# Altium project FM_V03_BASE.PrjPcb
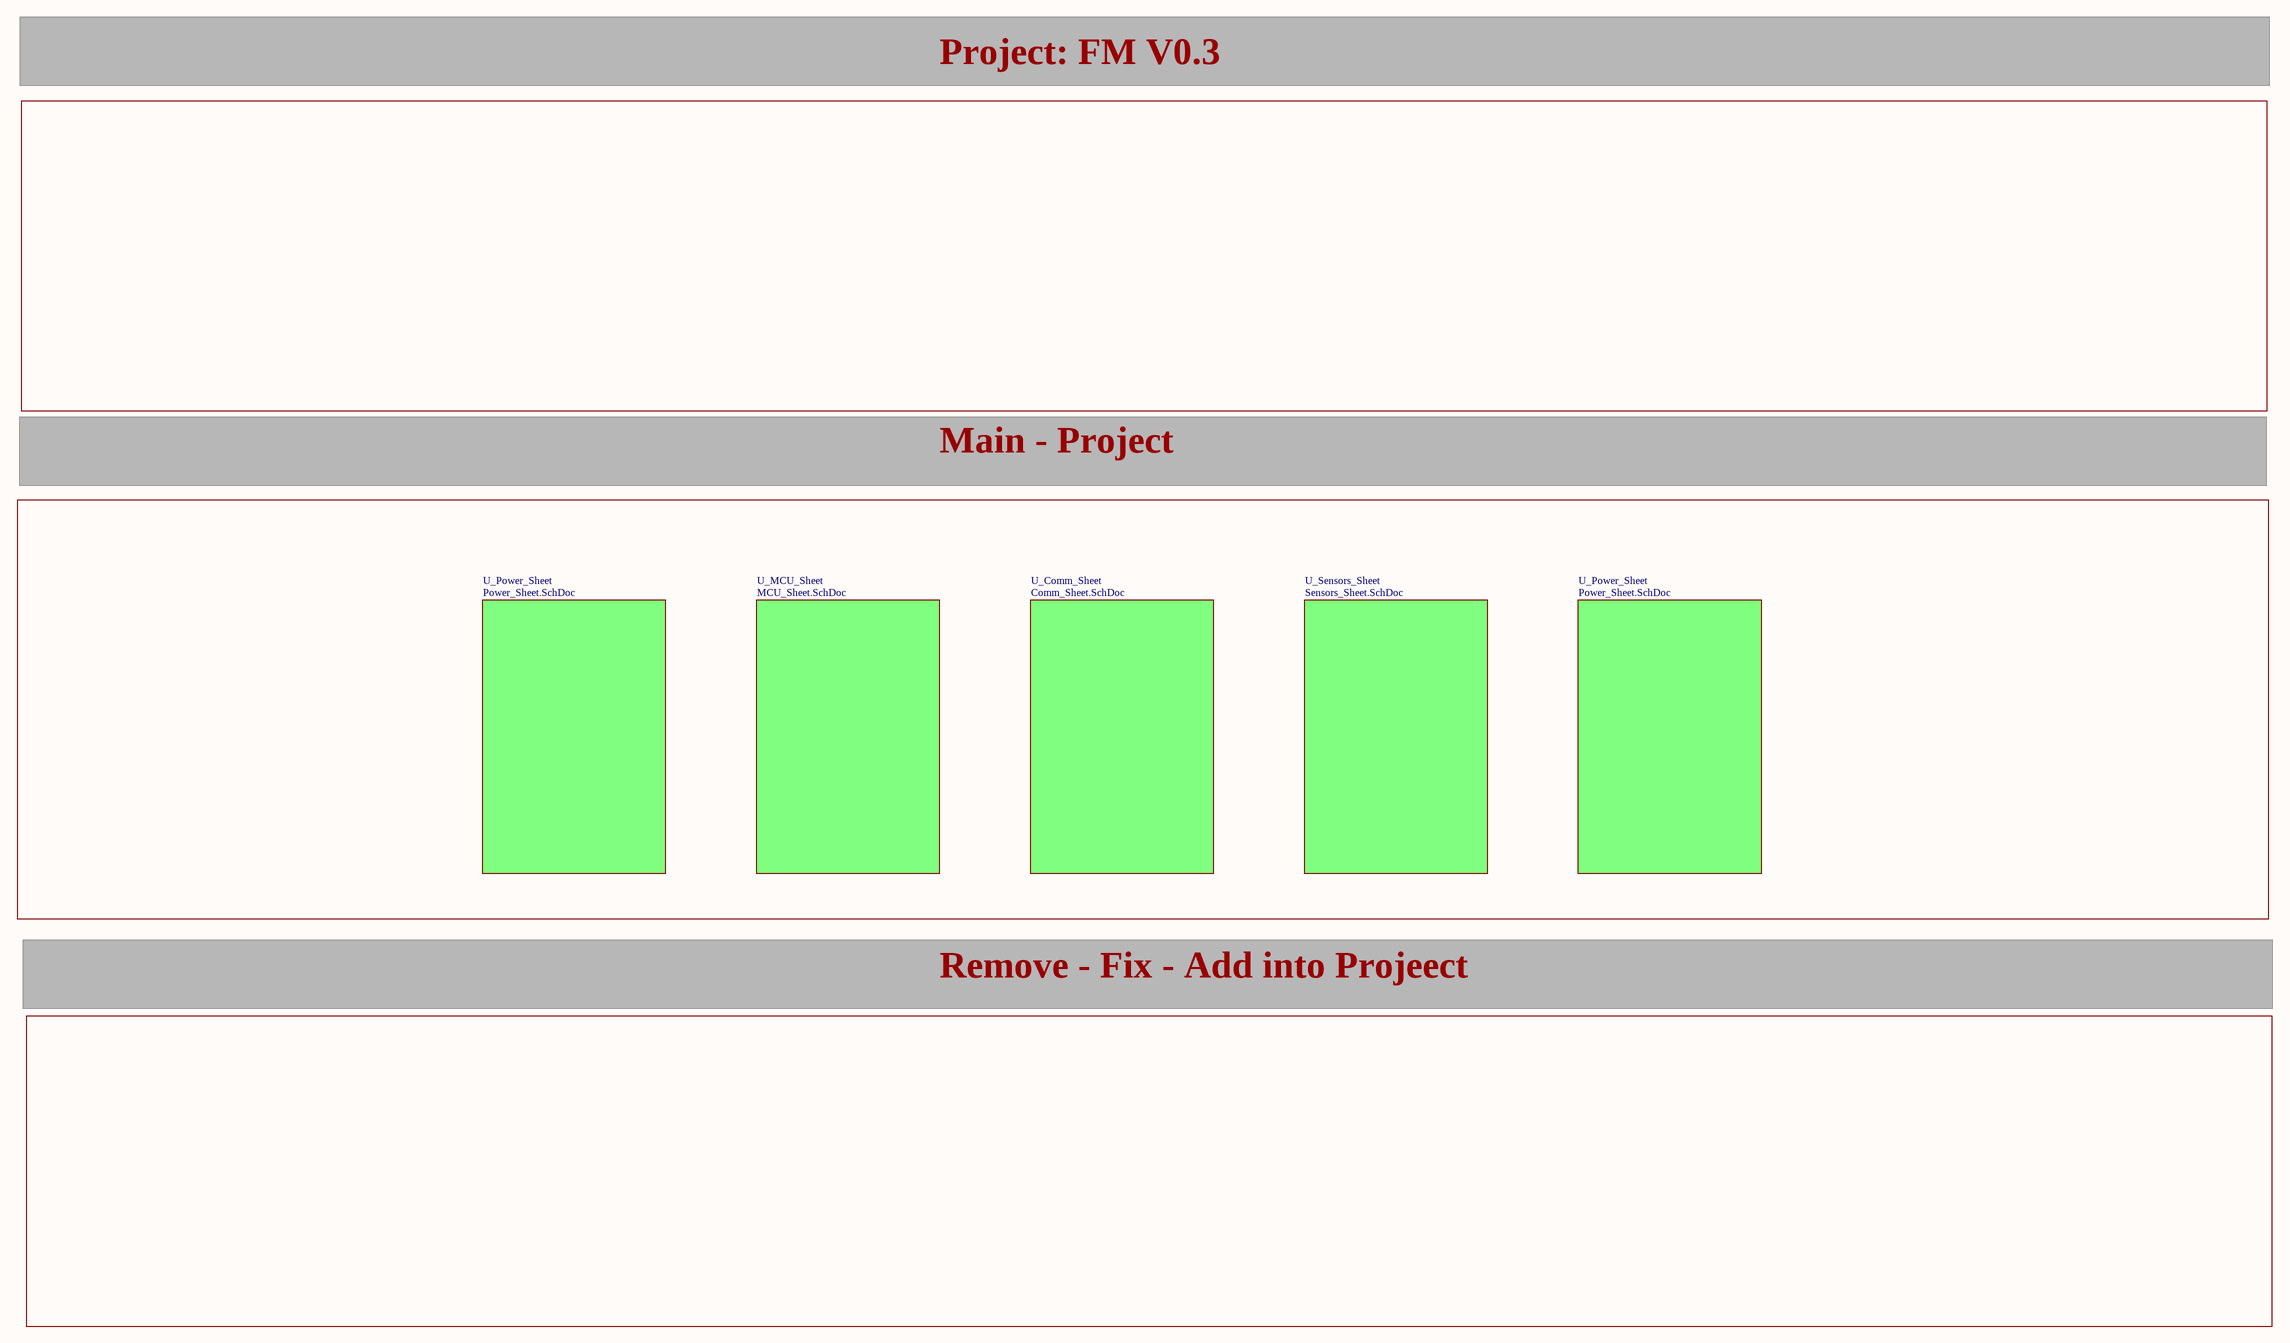
[diagram p0: Main_Sheet.SchDoc]
5 sheets, 199 parts. Net scope: flat (ports and power ports of the same name join across sheets).
Board file: PCB_FM_V03_BASE.PcbDoc
Sheets:
  Main_Sheet.SchDoc
    U_Power_Sheet = Power_Sheet.SchDoc
    U_MCU_Sheet = MCU_Sheet.SchDoc
    U_Comm_Sheet = Comm_Sheet.SchDoc
    U_Sensors_Sheet = Sensors_Sheet.SchDoc
    U_Power_Sheet = Power_Sheet.SchDoc

## Sheet Main_Sheet.SchDoc
size A2; SheetNumber: 1; SheetTotal: 5

### Sub-sheets
U_Comm_Sheet = Comm_Sheet.SchDoc: no entries
U_MCU_Sheet = MCU_Sheet.SchDoc: no entries
U_Power_Sheet = Power_Sheet.SchDoc: no entries
U_Power_Sheet = Power_Sheet.SchDoc: no entries
U_Sensors_Sheet = Sensors_Sheet.SchDoc: no entries

### Notes on the sheet
- Project: FM V0.3
- Main - Project
- Remove - Fix - Add into Projeect

## Sheet Power_Sheet.SchDoc
size A3; SheetNumber: 2; SheetTotal: 5
Used 2 times, as channels U_Power_Sheet, U_Power_Sheet. Parts and nets are listed once, with the designators drawn on the sheet.
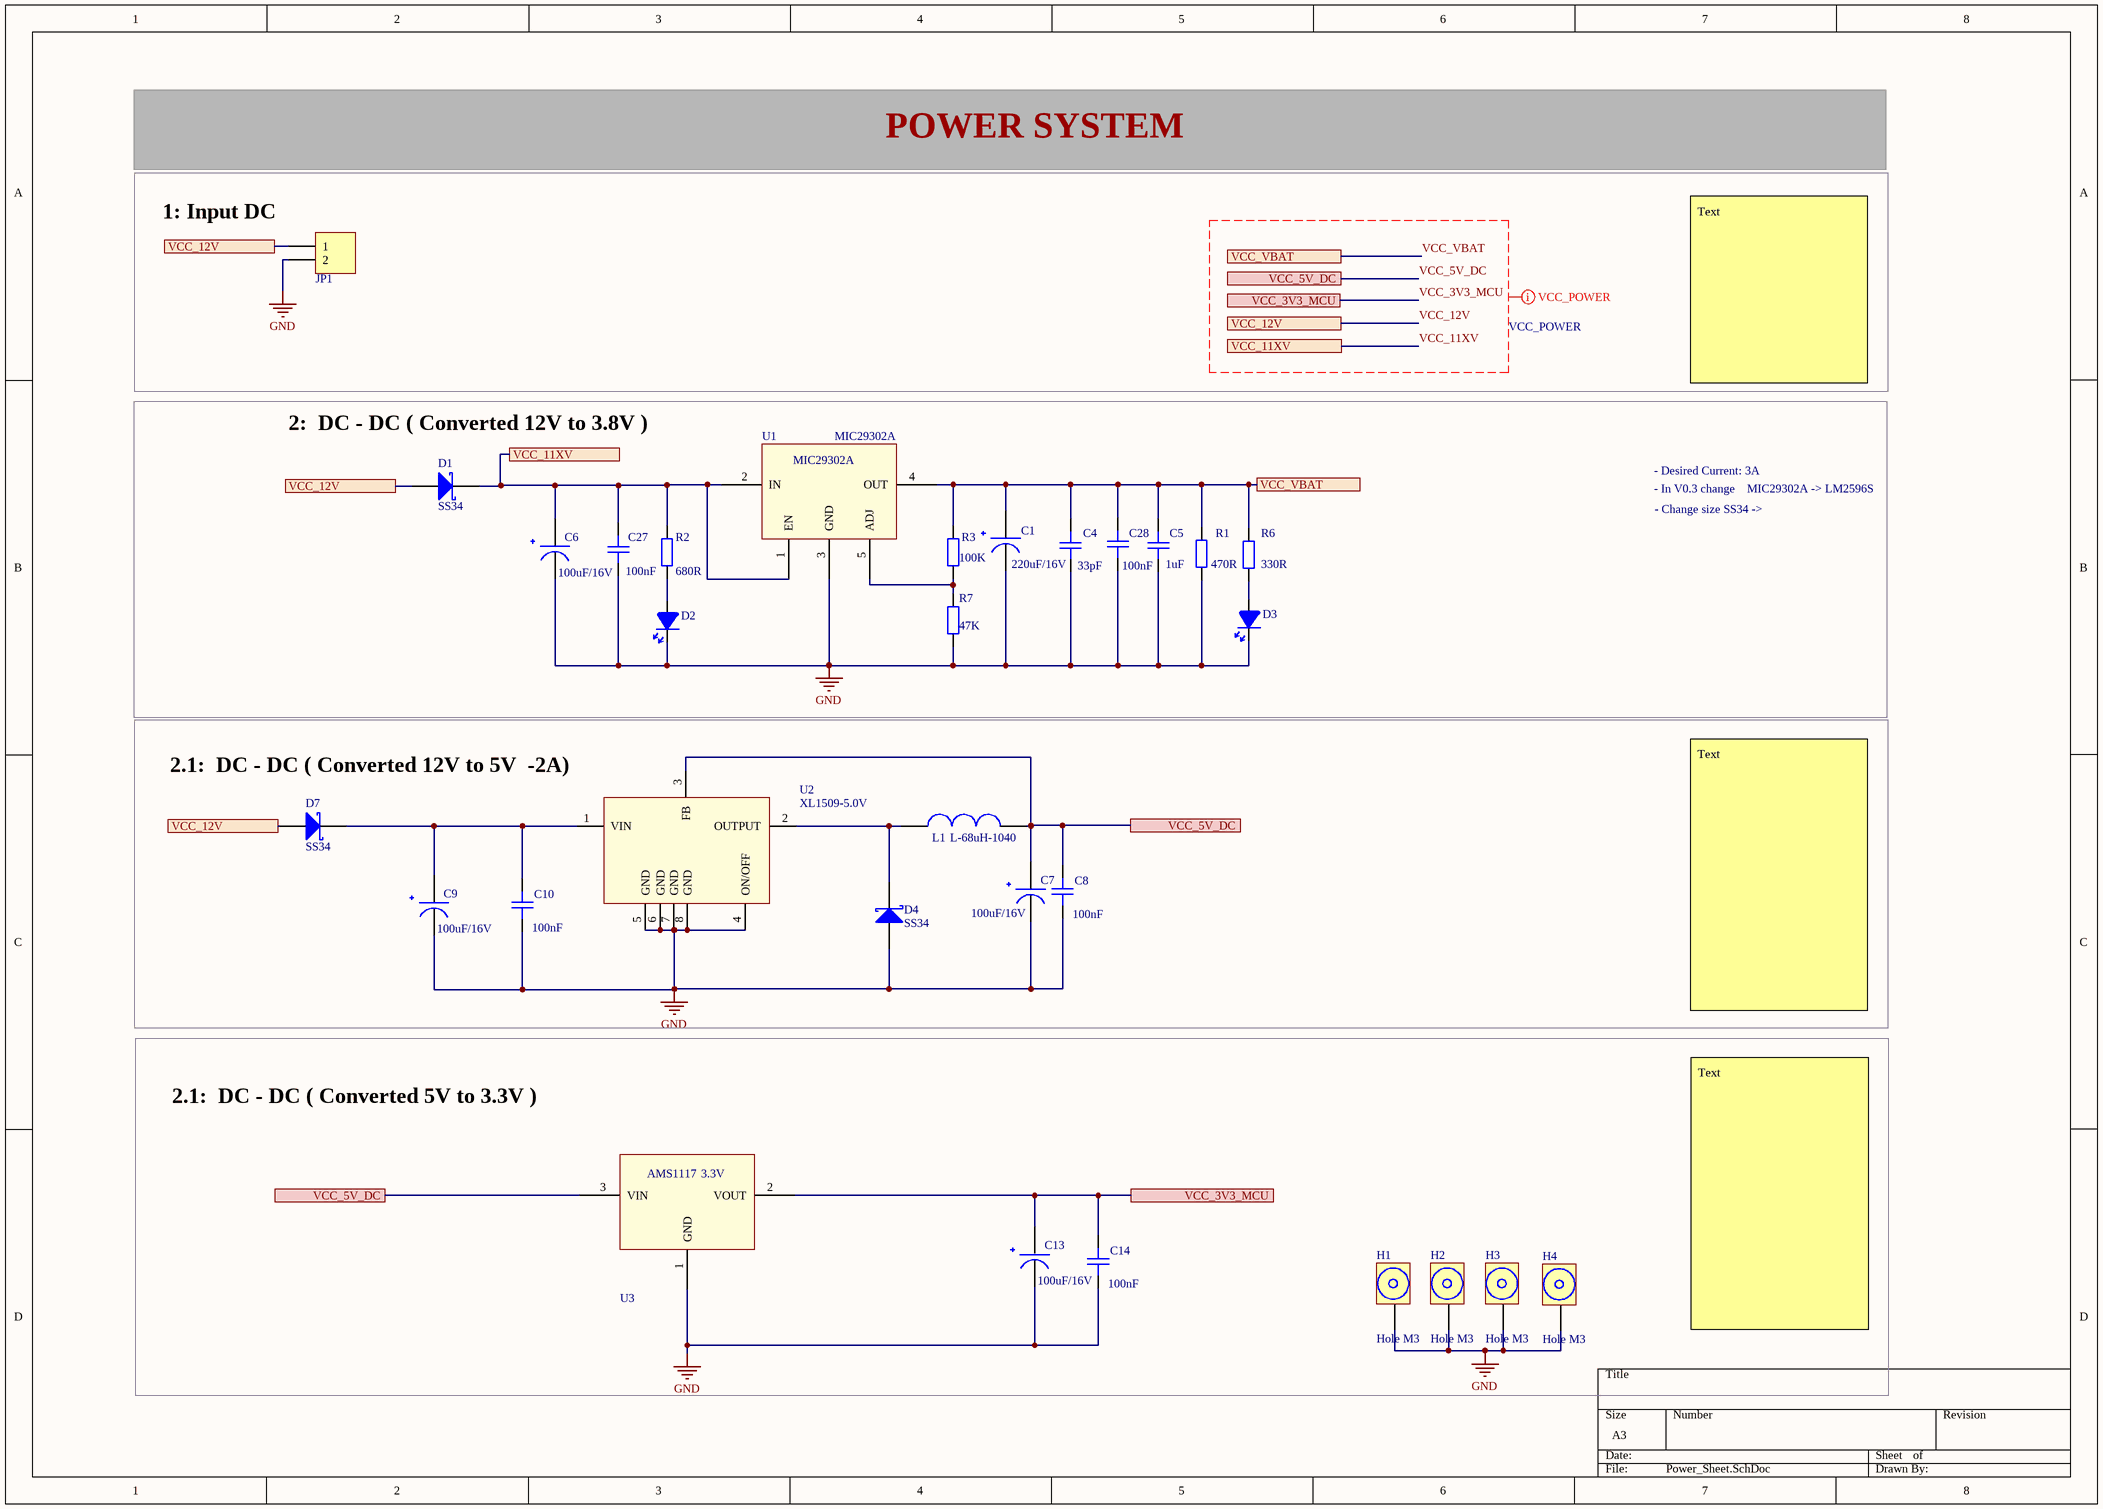
[diagram p1: Power_Sheet.SchDoc]

### Parts
C1  220uF/16V  [CAPACITOR 6.3x7.7mm]
C4  33pF  [CAPC-0603 (1608)]
C5  1uF  [CAPC-0603 (1608)]
C6  100uF/16V  [CAP 6.3MMx5.4MM]
C7  100uF/16V  [CAP 6.3MMx5.4MM]
C8  100nF  [CAPC-0603 (1608)]
C9  100uF/16V  [CAP 6.3MMx5.4MM]
C10  100nF  [CAPC-0603 (1608)]
C13  100uF/16V  [CAP 6.3MMx5.4MM]
C14  100nF  [CAPC-0603 (1608)]
C27  100nF  [CAPC-0603 (1608)]
C28  100nF  [CAPC-0603 (1608)]
D1  SS34  [DIODE_DO214AC_SMA]
D2  LED_0805_PW  [LED_0805_PW]  (value not drawn)
D3  LED_0805_PW  [LED_0805_PW]  (value not drawn)
D4  SS34  [DIODE_DO214AC_SMA]
D7  SS34  [DIODE_DO214AC_SMA]
H1  Hole M3  [Hole Size 3M]
H2  Hole M3  [Hole Size 3M]
H3  Hole M3  [Hole Size 3M]
H4  Hole M3  [Hole Size 3M]
JP1  Header 2_1  [HED2]  (value not drawn)
L1  L-68uH-1040  [68uH - 2A - 1040]
R1  470R  [RESC-0603 (1608)]
R2  680R  [RESC-0603 (1608)]
R3  100K  [RESC-0603 (1608)]
R6  330R  [RESC-0603 (1608)]
R7  47K  [RESC-0603 (1608)]
U1  MIC29302A  [MIC29302A]
U2  XL1509-5.0V  [XL1509-5V]
U3  AMS1117 - 3.3V  [AMS1117 -3.3V]  (value not drawn)

### Blocks framed on the sheet
1: Input DC: JP1
2:  DC - DC ( Converted 12V to 3.8V ): C1 C4-C6 C27 C28 D1-D3 R1-R3 R6 R7 U1
2.1:  DC - DC ( Converted 12V to 5V  -2A): C7-C10 D4 D7 L1 U2
2.1:  DC - DC ( Converted 5V to 3.3V ): C13 C14 H1-H4 U3

### Ports
VCC_3V3_MCU, VCC_5V_DC, VCC_11XV, VCC_12V, VCC_VBAT

### Nets
GND: C1.2 C4.1 C5.1 C6.2 C7.2 C8.1 C9.2 C10.1 C13.2 C14.1 C27.1 C28.1 D2.2(K) D3.2(K) D4.1(A) H1.1(GND) H2.1(GND) H3.1(GND) H4.1(GND) JP1.2 R1.1 R7.1 U1.3(GND) U2.4(ON/OFF) U2.5(GND) U2.6(GND) U2.7(GND) U2.8(GND) U3.1(GND)
VCC_3V3_MCU: C13.1 C14.2 U3.2(VOUT) ; port VCC_3V3_MCU
VCC_5V_DC: C7.1 C8.2 L1.2 U2.3(FB) U3.3(VIN) ; port VCC_5V_DC
VCC_11XV: C6.1 C27.2 D1.2(K) R2.2 U1.1(EN) U1.2(IN) ; port VCC_11XV
VCC_12V: D1.1(A) D7.1(A) JP1.1 ; port VCC_12V
VCC_VBAT: C1.1 C4.2 C5.2 C28.2 R1.2 R3.1 R6.2 U1.4(OUT) ; port VCC_VBAT
NetC9_1: C9.1 C10.2 D7.2(K) U2.1(VIN)
NetD2_1: D2.1(A) R2.1
NetD3_1: D3.1(A) R6.1
NetD4_2: D4.2(K) L1.1 U2.2(OUTPUT)
NetR3_2: R3.2 R7.2 U1.5(ADJ)

### Channels
U_Power_Sheet: designators end in _U_Power_Sheet#1; ports VCC_3V3_MCU=VCC_3V3_MCU VCC_5V_DC=VCC_5V_DC VCC_11XV=VCC_11XV VCC_12V=VCC_12V VCC_VBAT=VCC_VBAT
U_Power_Sheet: designators end in _U_Power_Sheet#2; ports VCC_3V3_MCU=VCC_3V3_MCU VCC_5V_DC=VCC_5V_DC VCC_11XV=VCC_11XV VCC_12V=VCC_12V VCC_VBAT=VCC_VBAT

### Layout directives
net class VCC_POWER: VCC_3V3_MCU, VCC_5V_DC, VCC_11XV, VCC_12V, VCC_VBAT

### Notes on the sheet
- POWER SYSTEM
- Text
- - Desired Current: 3A
- - In V0.3 change    MIC29302A -> LM2596S
- - Change size SS34 ->
- (in symbol AMS1117 - 3.3V) AMS1117; 3.3V

### Library data of the parts
C1 = CAP 220uF: Capacitor 220uF - 16V. Size 6.3x7,7mm
C4 C5 C8 C10 C14 C27 C28 = CAPC NF 0603: CAP SMD, Not Fill, 0603; Value: NF; Solder: Not Fill; Category: CAPACITOR
C6 C7 C9 C13 = CAP 100uF: Capacitor 100uF - 16V. Size 6.3x5.4mm
D1 D4 D7 = SS34: DIODE SCHOTTKY 40V 3A SMA; Solder: SMT; MPN: SS34; Value: SS34; MFR: *
JP1 = Header 2_1: Header, 2-Pin; Manufacturer: Generic Components; Class: Connector; Value: Header 2
R1-R3 R6 R7 = CRCW06035R10FKEA: RES SMD 5.1 OHM 1% 1/10W 0603; MFR: Vishay Dale; Value: 5.1R; Solder: SMT; MPN: CRCW06035R10FKEA; Category: RESISTOR; PinCount: 2
U2 = XL1509-5V: XL1509-5V FROM XLSEMI

## Sheet MCU_Sheet.SchDoc
size A2; SheetNumber: 3; SheetTotal: 5
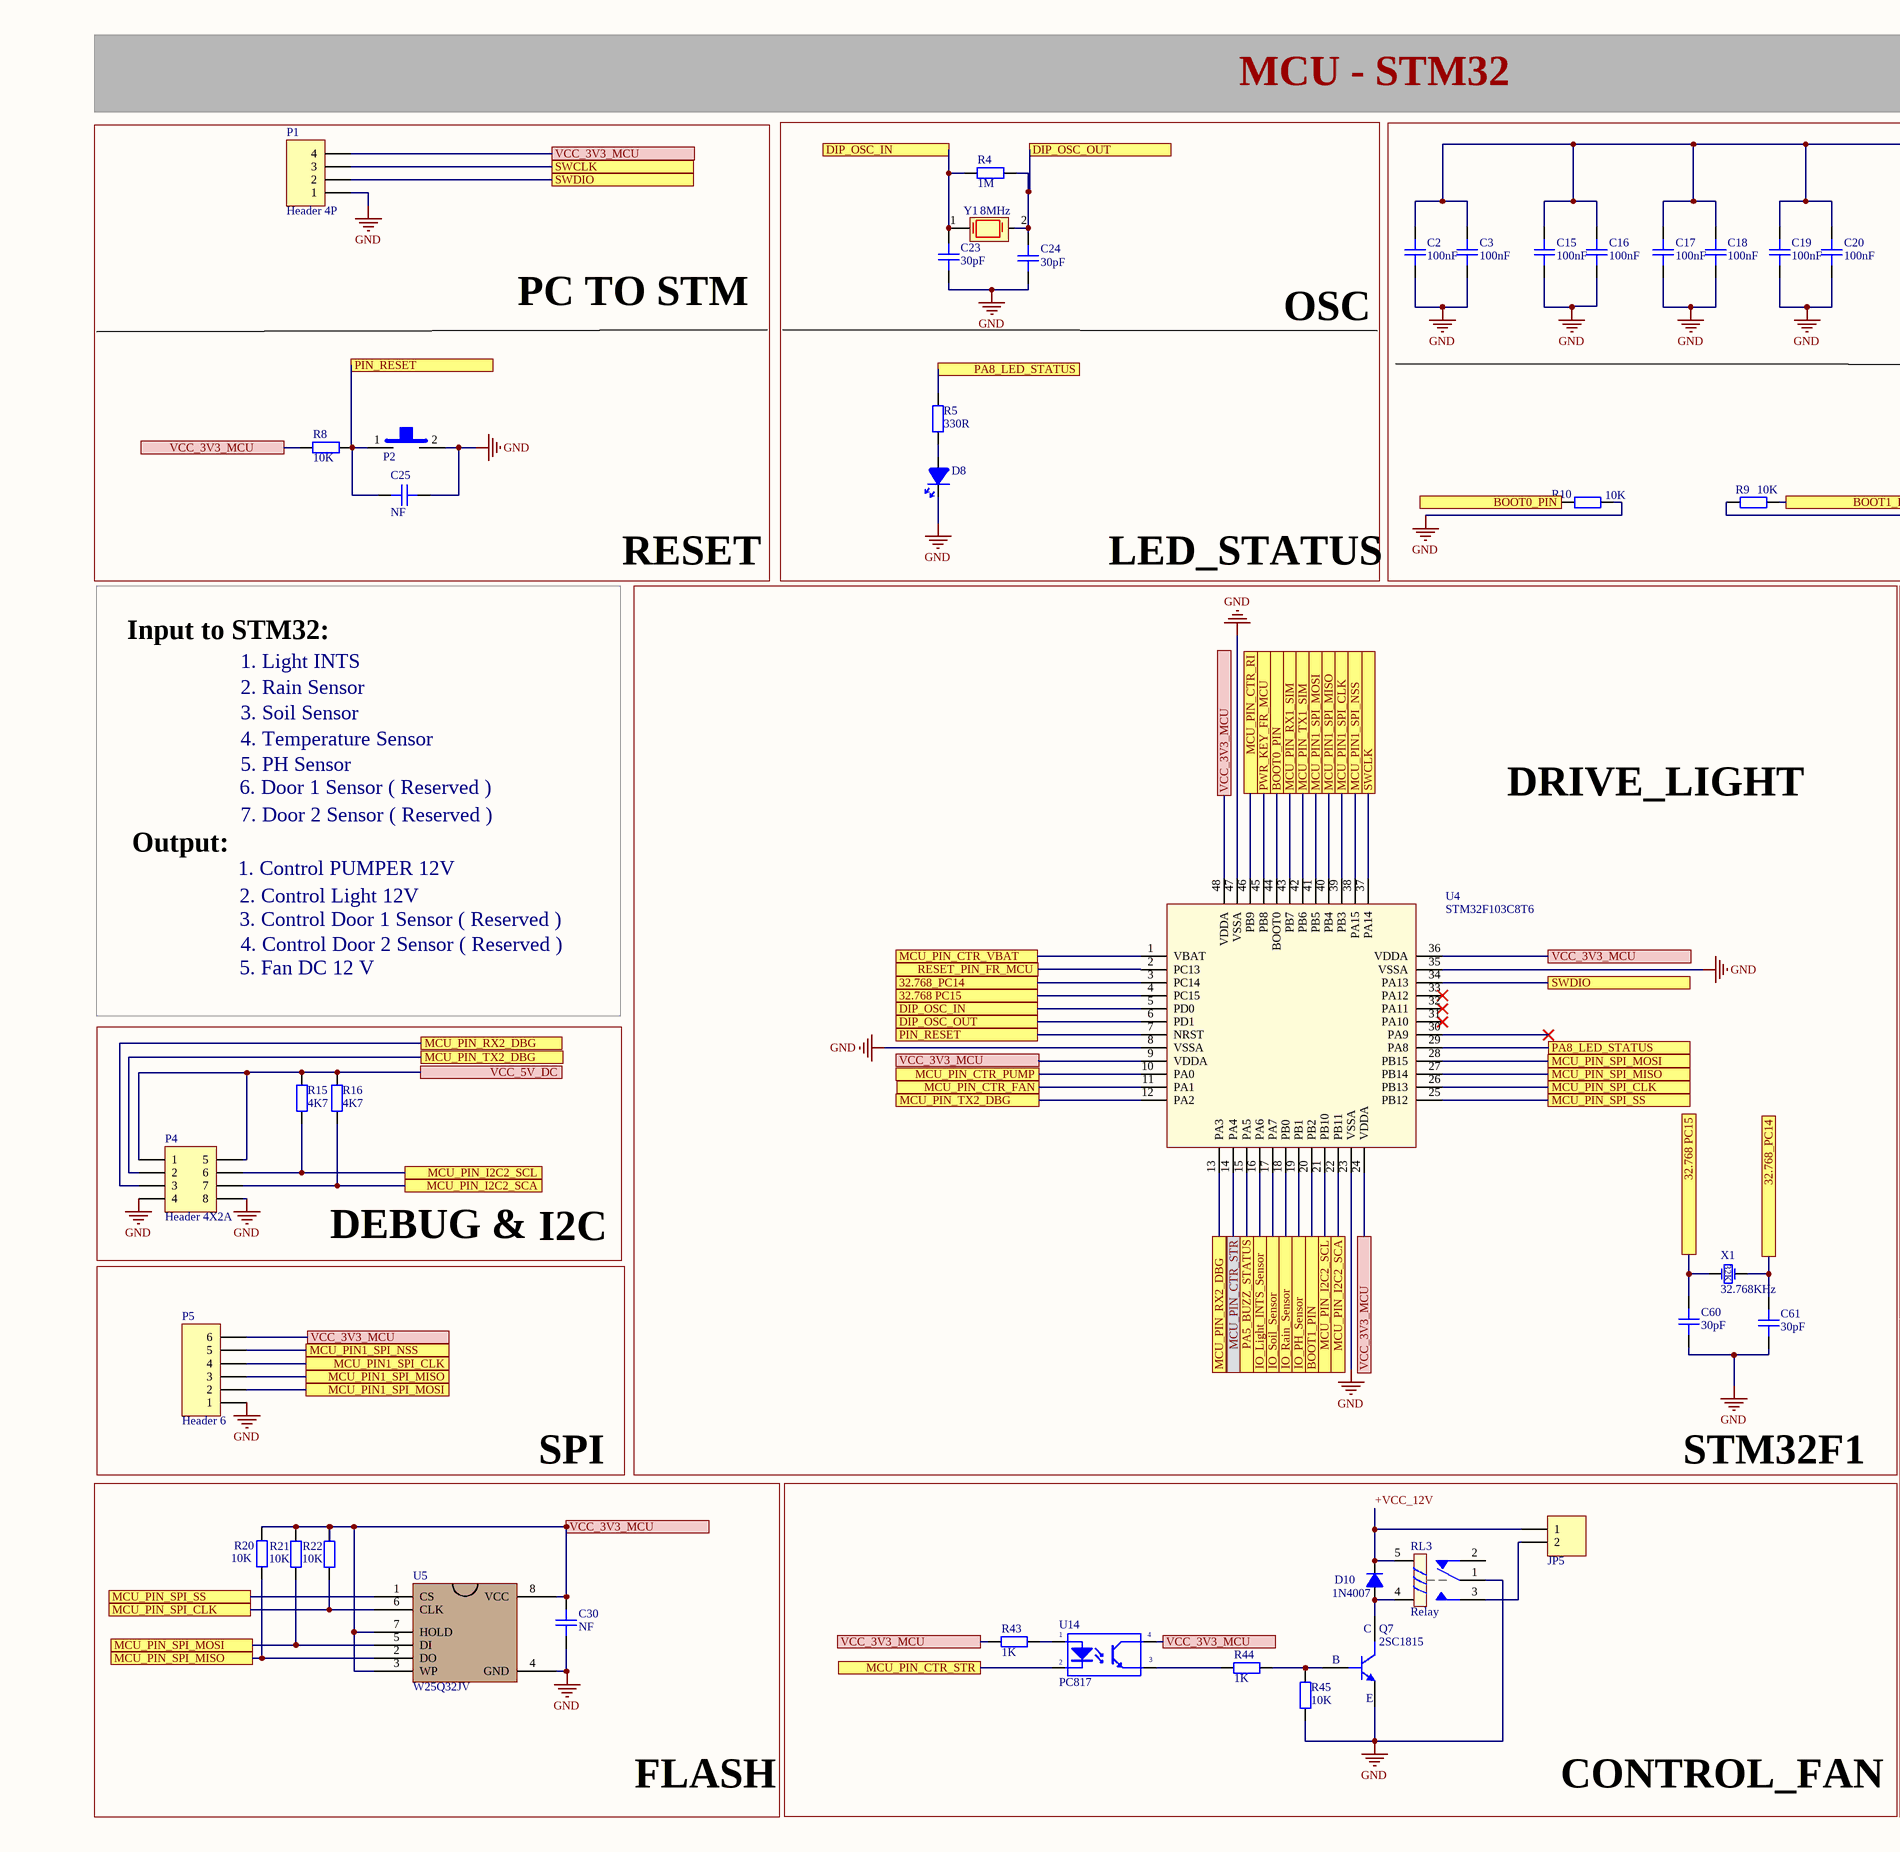
[diagram p2: MCU_Sheet.SchDoc, left]
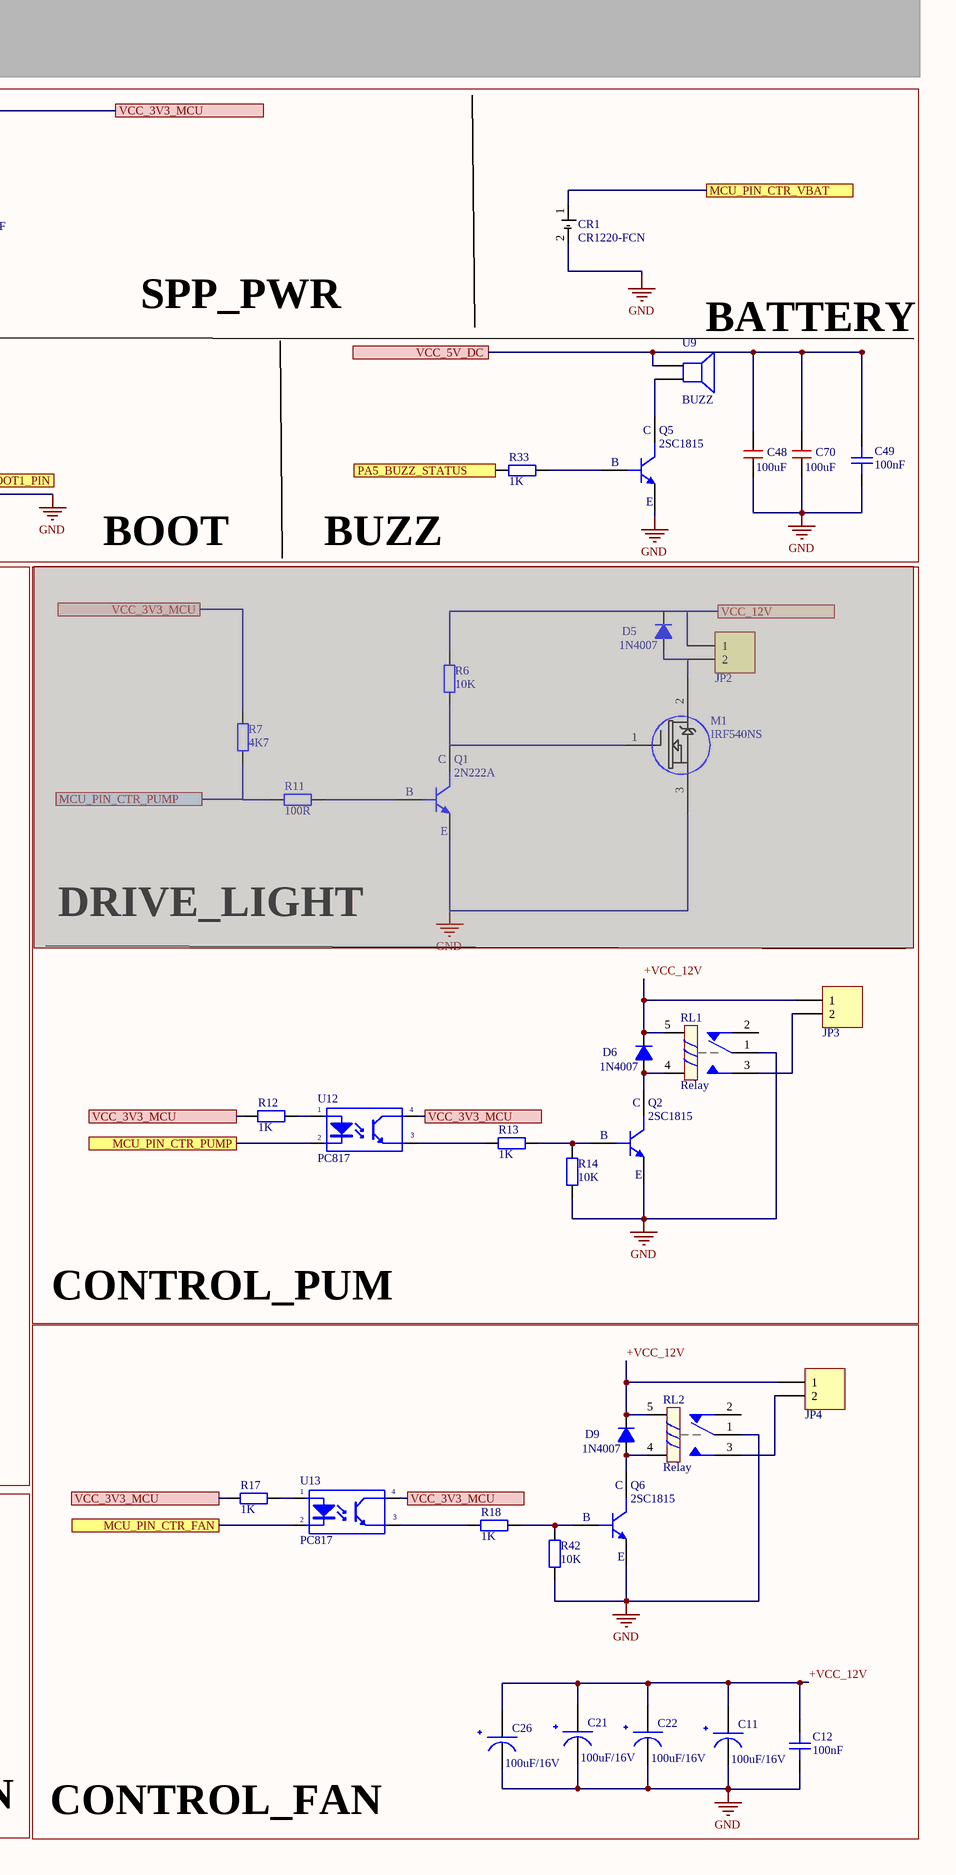
[diagram p3: MCU_Sheet.SchDoc, right]

### Parts
C2  100nF  [CAPC-0603 (1608)]
C3  100nF  [CAPC-0603 (1608)]
C11  100uF/16V  [CAP 6.3MMx5.4MM]
C12  100nF  [CAPC-0603 (1608)]
C15  100nF  [CAPC-0603 (1608)]
C16  100nF  [CAPC-0603 (1608)]
C17  100nF  [CAPC-0603 (1608)]
C18  100nF  [CAPC-0603 (1608)]
C19  100nF  [CAPC-0603 (1608)]
C20  100nF  [CAPC-0603 (1608)]
C21  100uF/16V  [CAP 6.3MMx5.4MM]
C22  100uF/16V  [CAP 6.3MMx5.4MM]
C23  30pF  [CAPC-0603 (1608)]
C24  30pF  [CAPC-0603 (1608)]
C25  NF  [CAPC-0603 (1608)]
C26  100uF/16V  [CAP 6.3MMx5.4MM]
C30  NF  [CAPC-0603 (1608)]
C48  100uF  [100uF 1210 SMD]
C49  100nF  [CAPC-0603 (1608)]
C60  30pF  [CAPC-0603 (1608)]
C61  30pF  [CAPC-0603 (1608)]
C70  100uF  [100uF 1210 SMD]
CR1  CR1220-FCN  [CR1220]
D5  1N4007  [DO-214AC]  (masked out: inside a compile mask, not in the netlist)
D6  1N4007  [DO-214AC]
D8  LED_0805_PW  [LED_0805_PW]  (value not drawn)
D9  1N4007  [DO-214AC]
D10  1N4007  [DO-214AC]
JP2  Header 2_1  [HED2]  (value not drawn)  (masked out: inside a compile mask, not in the netlist)
JP3  Header 2_1  [HED2]  (value not drawn)
JP4  Header 2_1  [HED2]  (value not drawn)
JP5  Header 2_1  [HED2]  (value not drawn)
M1  IRF540NS  [IRF540NS]  (masked out: inside a compile mask, not in the netlist)
P1  Header 4P  [HDR1X4]
P2  (no value)  [SW 2P SMD]
P4  Header 4X2A  [HDR2X4_CEN]
P5  Header 6  [HDR1X6]
Q1  2N222A  [SOT23_3]  (masked out: inside a compile mask, not in the netlist)
Q2  2SC1815  [SOT23_3]
Q5  2SC1815  [SOT23_3]
Q6  2SC1815  [SOT23_3]
Q7  2SC1815  [SOT23_3]
R4  1M  [RESC-0603 (1608)]
R5  330R  [RESC-0603 (1608)]
R6  10K  [RESC-0603 (1608)]  (masked out: inside a compile mask, not in the netlist)
R7  4K7  [RESC-0603 (1608)]  (masked out: inside a compile mask, not in the netlist)
R8  10K  [RESC-0603 (1608)]
R9  10K  [RESC-0603 (1608)]
R10  10K  [RESC-0603 (1608)]
R11  100R  [RESC-0603 (1608)]  (masked out: inside a compile mask, not in the netlist)
R12  1K  [RESC-0603 (1608)]
R13  1K  [RESC-0603 (1608)]
R14  10K  [RESC-0603 (1608)]
R15  4K7  [RESC-0603 (1608)]
R16  4K7  [RESC-0603 (1608)]
R17  1K  [RESC-0603 (1608)]
R18  1K  [RESC-0603 (1608)]
R20  10K  [RESC-0603 (1608)]
R21  10K  [RESC-0603 (1608)]
R22  10K  [RESC-0603 (1608)]
R33  1K  [RESC-0603 (1608)]
R42  10K  [RESC-0603 (1608)]
R43  1K  [RESC-0603 (1608)]
R44  1K  [RESC-0603 (1608)]
R45  10K  [RESC-0603 (1608)]
RL1  Relay  [RL_SPDT_10A]
RL2  Relay  [RL_SPDT_10A]
RL3  Relay  [RL_SPDT_10A]
U4  STM32F103C8T6  [STM32F103C8T6]
U5  W25Q32JV  [W2Q532JV]
U9  BUZZ  [BUZZER_through_hole]
U12  PC817  [DIP4/W0.3]
U13  PC817  [DIP4/W0.3]
U14  PC817  [DIP4/W0.3]
X1  32.768KHz  [Crystal_ABS07_SMD-3.2x1.5MM]
Y1  8MHz  [CRYSTAL - 8Mhz]

### Ports
32.768 PC15, 32.768_PC14, BOOT0_PIN, BOOT1_PIN, DIP_OSC_IN, DIP_OSC_OUT, IO_Light_INTS_Sensor, IO_PH_Sensor, IO_Rain_Sensor, IO_Soil_Sensor, MCU_PIN1_SPI_CLK, MCU_PIN1_SPI_MISO, MCU_PIN1_SPI_MOSI, MCU_PIN1_SPI_NSS, MCU_PIN_CTR_FAN, MCU_PIN_CTR_PUMP, MCU_PIN_CTR_RI, MCU_PIN_CTR_STR, MCU_PIN_CTR_VBAT, MCU_PIN_I2C2_SCA, MCU_PIN_I2C2_SCL, MCU_PIN_RX1_SIM, MCU_PIN_RX2_DBG, MCU_PIN_SPI_CLK, MCU_PIN_SPI_MISO, MCU_PIN_SPI_MOSI, MCU_PIN_SPI_SS, MCU_PIN_TX1_SIM, MCU_PIN_TX2_DBG, PA5_BUZZ_STATUS, PA8_LED_STATUS, PIN_RESET, PWR_KEY_FR_MCU, RESET_PIN_FR_MCU, SWCLK, SWDIO, VCC_3V3_MCU, VCC_5V_DC, VCC_12V

### Nets
GND: C2.1 C3.1 C11.2 C12.1 C15.1 C16.1 C17.1 C18.1 C19.1 C20.1 C21.2 C22.2 C23.1 C24.1 C25.1 C26.2 C30.1 C48.1 C49.1 C60.2 C61.2 C70.1 CR1.2 D8.2(K) P1.1 P2.2 P4.4 P4.8 P5.1 Q2.2(E) Q5.2(E) Q6.2(E) Q7.2(E) R9.1 R10.2 R14.1 R42.1 R45.1 RL1.1 RL2.1 RL3.1 U4.8(VSSA) U4.23(VSSA) U4.35(VSSA) U4.47(VSSA) U5.4(GND)
+VCC_12V: C11.1 C12.2 C21.1 C22.1 C26.1 D6.K D9.K D10.K JP3.1 JP4.1 JP5.1 RL1.5 RL2.5 RL3.5
VCC_3V3_MCU: C2.2 C3.2 C15.2 C16.2 C17.2 C18.2 C19.2 C20.2 C30.2 P1.4 P5.6 R8.1 R12.2 R17.2 R20.2 R21.2 R22.2 R43.2 U4.9(VDDA) U4.24(VDDA) U4.36(VDDA) U4.48(VDDA) U5.3(WP) U5.7(HOLD) U5.8(VCC) U12.4(C) U13.4(C) U14.4(C) ; port VCC_3V3_MCU
VCC_5V_DC: C48.2 C49.2 C70.2 P4.1 P4.5 R15.1 R16.1 U9.1 ; port VCC_5V_DC
NetC23_2: C23.2 R4.2 U4.5(PD0) Y1.1 ; port DIP_OSC_IN
NetC24_2: C24.2 R4.1 U4.6(PD1) Y1.2 ; port DIP_OSC_OUT
NetC25_2: C25.2 P2.1 R8.2 U4.7(NRST) ; port PIN_RESET
NetC50_2: U4.19(PB1) ; port IO_PH_Sensor
NetC60_1: C60.1 U4.4(PC15) X1.2(OSC2) ; port 32.768 PC15
NetC61_1: C61.1 U4.3(PC14) X1.1(OSC1) ; port 32.768_PC14
NetCR1_1: CR1.1 U4.1(VBAT) ; port MCU_PIN_CTR_VBAT
NetD6_A: D6.A Q2.3(C) RL1.4
NetD8_1: D8.1(A) R5.2
NetD9_A: D9.A Q6.3(C) RL2.4
NetD10_A: D10.A Q7.3(C) RL3.4
NetJP3_2: JP3.2 RL1.3
NetJP4_2: JP4.2 RL2.3
NetJP5_2: JP5.2 RL3.3
NetP1_2: P1.2 U4.34(PA13) ; port SWDIO
NetP1_3: P1.3 U4.37(PA14) ; port SWCLK
NetP3_1: U4.18(PB0) ; port IO_Rain_Sensor
NetP4_2: P4.2 U4.12(PA2) ; port MCU_PIN_TX2_DBG
NetP4_3: P4.3 U4.13(PA3) ; port MCU_PIN_RX2_DBG
NetP4_6: P4.6 R15.2 U4.21(PB10) ; port MCU_PIN_I2C2_SCL
NetP4_7: P4.7 R16.2 U4.22(PB11) ; port MCU_PIN_I2C2_SCA
NetP5_2: P5.2 U4.41(PB5) ; port MCU_PIN1_SPI_MOSI
NetP5_3: P5.3 U4.40(PB4) ; port MCU_PIN1_SPI_MISO
NetP5_4: P5.4 U4.39(PB3) ; port MCU_PIN1_SPI_CLK
NetP5_5: P5.5 U4.38(PA15) ; port MCU_PIN1_SPI_NSS
NetP6_1: U4.17(PA7) ; port IO_Soil_Sensor
NetP8_1: U4.16(PA6) ; port IO_Light_INTS_Sensor
NetQ2_1: Q2.1(B) R13.2 R14.2
NetQ5_1: Q5.1(B) R33.2
NetQ5_3: Q5.3(C) U9.2
NetQ6_1: Q6.1(B) R18.2 R42.2
NetQ7_1: Q7.1(B) R44.2 R45.2
NetR5_1: R5.1 U4.29(PA8) ; port PA8_LED_STATUS
NetR9_2: R9.2 U4.20(PB2) ; port BOOT1_PIN
NetR10_1: R10.1 U4.44(BOOT0) ; port BOOT0_PIN
NetR12_1: R12.1 U12.1(A)
NetR13_1: R13.1 U12.3(E)
NetR17_1: R17.1 U13.1(A)
NetR18_1: R18.1 U13.3(E)
NetR19_2: U4.45(PB8) ; port PWR_KEY_FR_MCU
NetR20_1: R20.1 U4.27(PB14) U5.2(DO) ; port MCU_PIN_SPI_MISO
NetR21_1: R21.1 U4.28(PB15) U5.5(DI) ; port MCU_PIN_SPI_MOSI
NetR22_1: R22.1 U4.26(PB13) U5.6(CLK) ; port MCU_PIN_SPI_CLK
NetR24_2: U4.2(PC13) ; port RESET_PIN_FR_MCU
NetR33_1: R33.1 U4.15(PA5) ; port PA5_BUZZ_STATUS
NetR43_1: R43.1 U14.1(A)
NetR44_1: R44.1 U14.3(E)
NetTP1_1: U4.43(PB7) ; port MCU_PIN_RX1_SIM
NetTP2_1: U4.42(PB6) ; port MCU_PIN_TX1_SIM
NetTP6_1: U4.46(PB9) ; port MCU_PIN_CTR_RI
NetU4_10: U4.10(PA0) U12.2(K) ; port MCU_PIN_CTR_PUMP
NetU4_11: U4.11(PA1) U13.2(K) ; port MCU_PIN_CTR_FAN
NetU4_14: U4.14(PA4) U14.2(K) ; port MCU_PIN_CTR_STR
NetU4_25: U4.25(PB12) U5.1(CS) ; port MCU_PIN_SPI_SS

Not connected (* = marked no-connect by the designer): RL1 2; RL2 2; RL3 2; U4 30(PA9)* 31(PA10)* 32(PA11)* 33(PA12)*

### Notes on the sheet
- MCU - STM32
- PC TO STM
- OSC
- SPP_PWR
- (near U9) BATTERY
- RESET
- LED_STATUS
- BOOT
- BUZZ
- Input to STM32:
- 1. Light INTS
- 2. Rain Sensor
- 3. Soil Sensor
- 4. Temperature Sensor
- 6. Door 1 Sensor ( Reserved )
- 5. PH Sensor
- DRIVE_LIGHT
- Output:
- 1. Control PUMPER 12V
- 7. Door 2 Sensor ( Reserved )
- 2. Control Light 12V
- 3. Control Door 1 Sensor ( Reserved )
- 5. Fan DC 12 V
- 4. Control Door 2 Sensor ( Reserved )
- DEBUG &
- I2C
- CONTROL_PUM
- SPI
- STM32F1
- FLASH
- CONTROL_FAN
- (in symbol ABS07-32.768KHZ-T) 32K

### Library data of the parts
C2 C3 C12 C15-C20 C23 C24 C49 C60 C61 = CAPC NF 0603: CAP SMD, Not Fill, 0603; Value: NF; Solder: Not Fill; Category: CAPACITOR
C11 C21 C22 C26 = CAP 100uF: Capacitor 100uF - 16V. Size 6.3x5.4mm
C25 C30 = CAPC NF 0603: CAP SMD, Not Fill, 0603; Solder: Not Fill; Value: NF; Category: CAPACITOR
C48 C70 = CAP SMD 1210 100uF
D5 D6 D9 D10 = Diode  1N4007: Diode 1A; Value: 1N4007
JP2-JP5 = Header 2_1: as JP1 on sheet Power_Sheet; Value: Header 2
P1 = Header 4x1: Header, 4 Pin Pitch 2.54mm; MPN: S1012EC-40-ND; CompanyID: VT-00125; Solder: WAVE; Value: Header 4P
P2 = Button 2 SMD: SMD Mini Push Button Switch 2 Pin 3x6x2.7mm; MPN: SMD Mini Push Button 2 SMD; Link: https://ram-e-shop.com/product/press2pin-smd/
P4 = Header 4X2A: Header, 4-Pin, Dual row; Solder: WAVE
P5 = Header 6: Header, 6-Pin; Solder: WAVE
Q1 Q2 Q5-Q7 = 2SC1815: TRANS NPN 50V 0.15A SOT23-3; Solder: SMT; MPN: 2SC1815; Value: 2SC1815
R4-R18 R20-R22 R33 R42-R45 = CRCW06035R10FKEA: as R1 on sheet Power_Sheet; MPN: CRCW06035R10FKEA; Category: RESISTOR; PinCount: 2
RL1-RL3 = Relay SRD: Relay SPDT 5 Pin; Value: Relay SPDT, 10A, 12V
U9 = Speaker: Loudspeaker
U12-U14 = PC817: Single Opto; Value: PC817
X1 = ABS07-32.768KHZ-T: CRYSTAL 32.7680KHZ 12.5pF SMD; Solder: SMT; CompanyID: VT-01153; MPN: ABS07-32.768KHZ-T; Value: 32.768KHz; Category: CRYSTAL
Y1 = CRYSTAL - 8MHZ

## Sheet Comm_Sheet.SchDoc
size A3; SheetNumber: 4; SheetTotal: 5
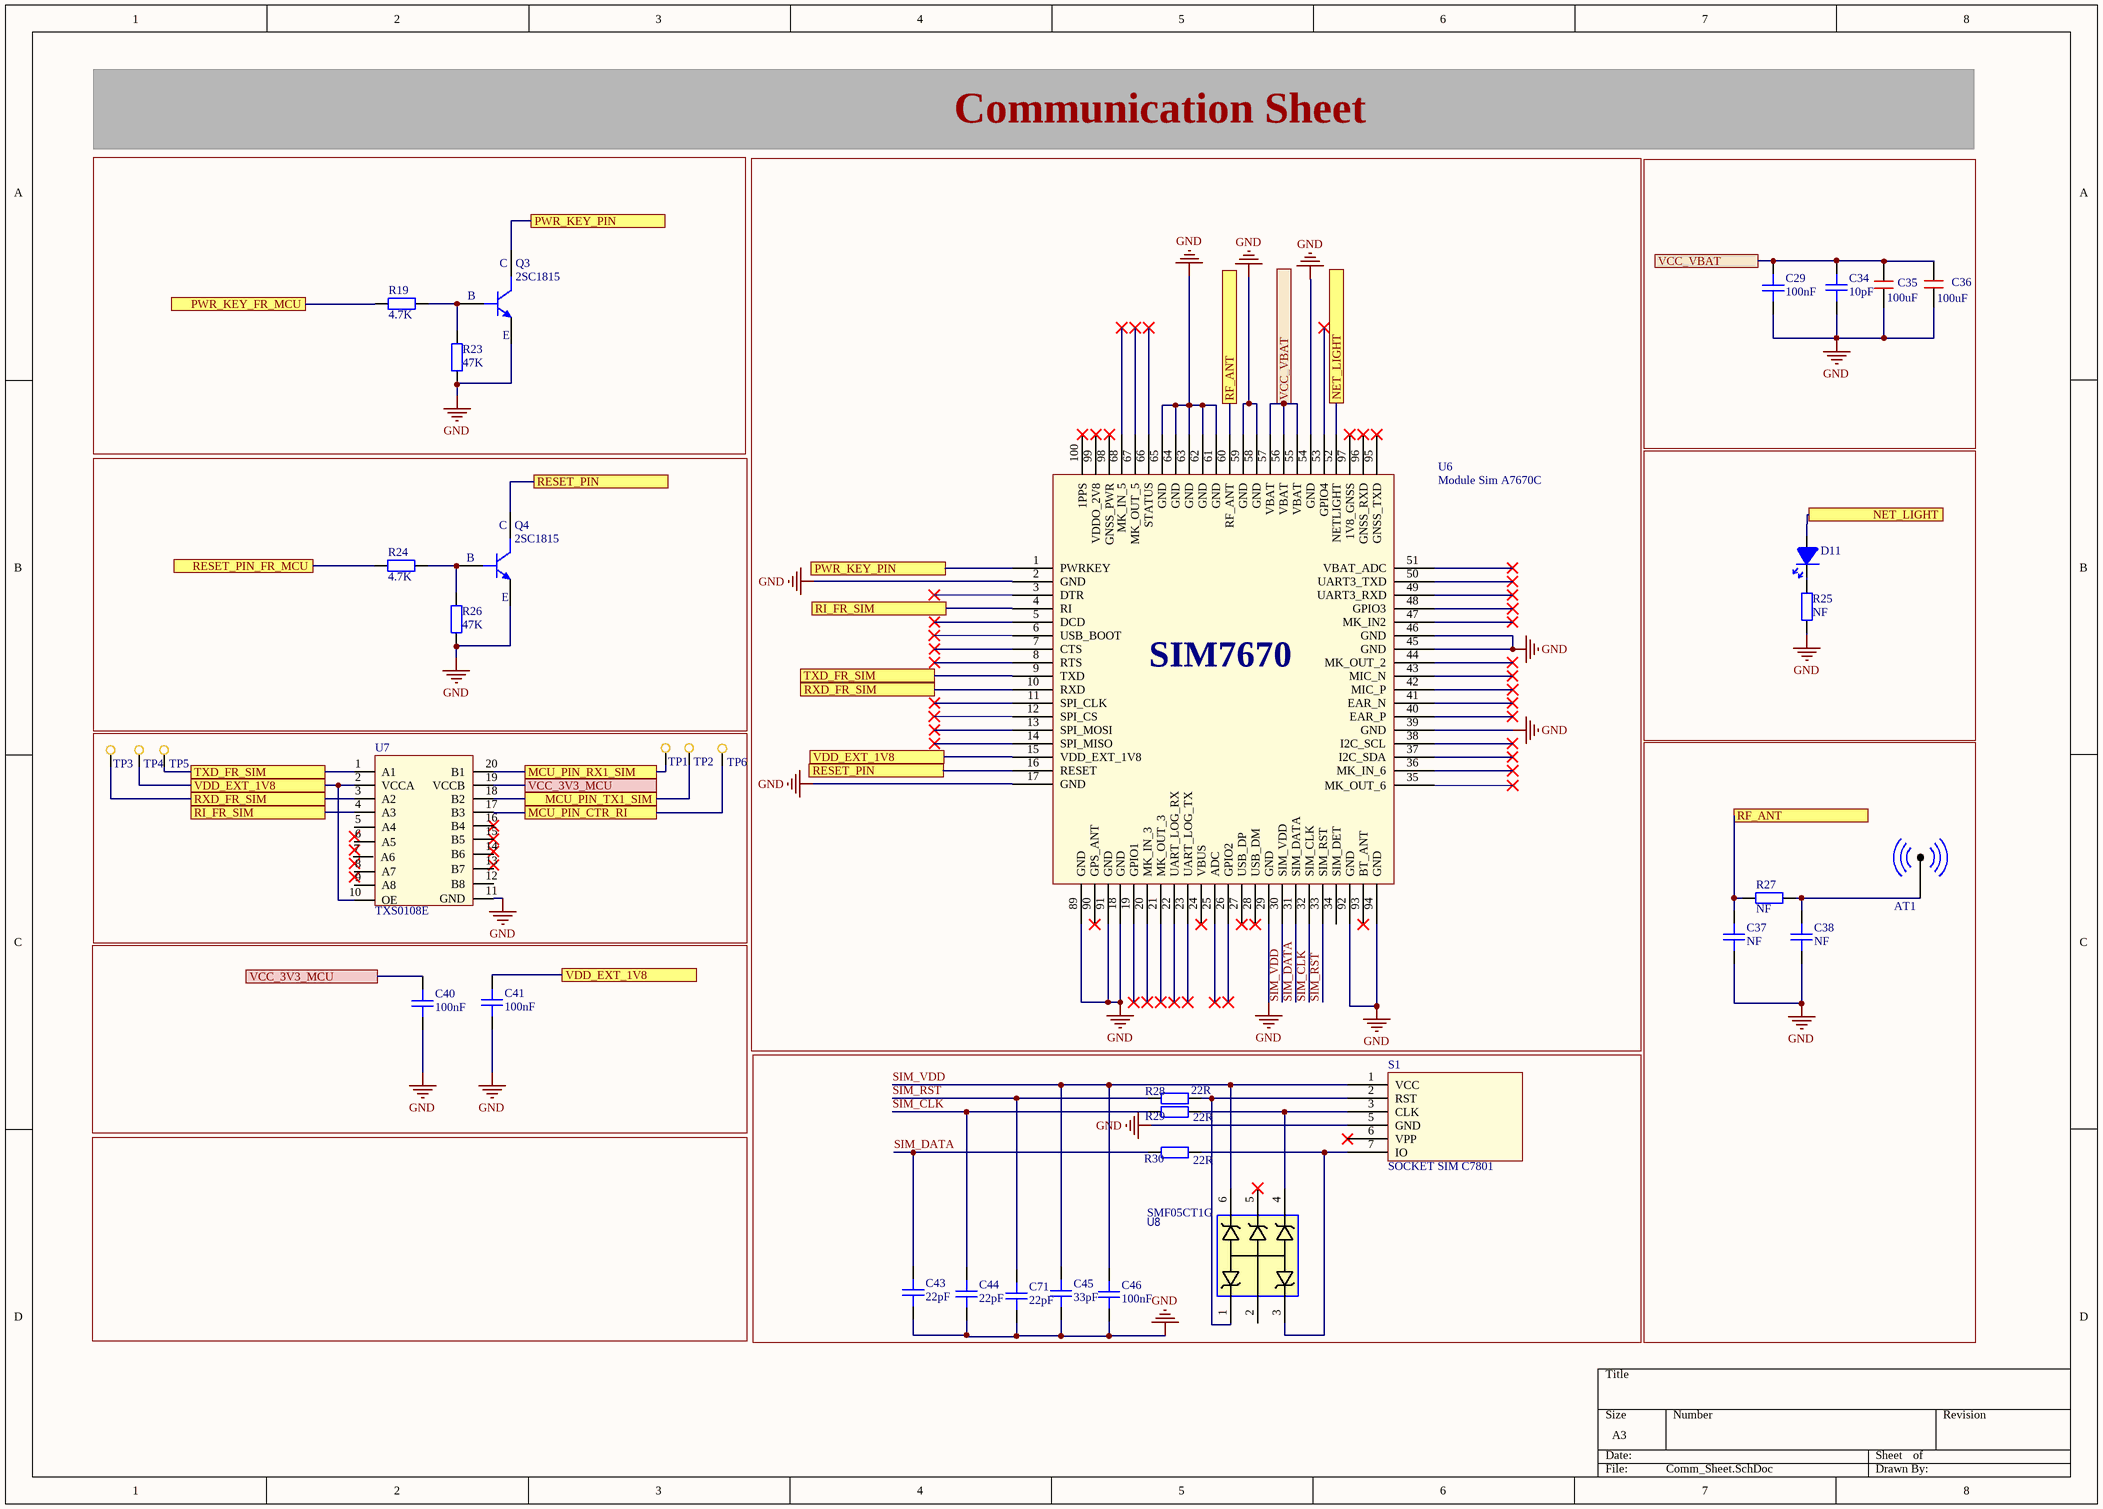
[diagram p4: Comm_Sheet.SchDoc]

### Parts
AT1  AT-GSM-GPS  [ANTENA - SMA2]  (value not drawn)
C29  100nF  [CAPC-0603 (1608)]
C34  10pF  [CAPC-0603 (1608)]
C35  100uF  [100uF 1210 SMD]
C36  100uF  [100uF 1210 SMD]
C37  NF  [CAPC-0603 (1608)]
C38  NF  [CAPC-0603 (1608)]
C40  100nF  [CAPC-0603 (1608)]
C41  100nF  [CAPC-0603 (1608)]
C43  22pF  [CAPC-0603 (1608)]
C44  22pF  [CAPC-0603 (1608)]
C45  33pF  [CAPC-0603 (1608)]
C46  100nF  [CAPC-0603 (1608)]
C71  22pF  [CAPC-0603 (1608)]
D11  LED_0805_PW  [LED_0805_PW]  (value not drawn)
Q3  2SC1815  [SOT23_3]
Q4  2SC1815  [SOT23_3]
R19  4.7K  [RESC-0603 (1608)]
R23  47K  [RESC-0603 (1608)]
R24  4.7K  [RESC-0603 (1608)]
R25  NF  [RESC-0603 (1608)]
R26  47K  [RESC-0603 (1608)]
R27  NF  [RESC-0603 (1608)]
R28  22R  [RESC-0603 (1608)]
R29  22R  [RESC-0603 (1608)]
R30  22R  [RESC-0603 (1608)]
S1  SOCKET SIM C7801  [SOCKET SIM]
TP1  Testpoint-1mm  [TestPoint]  (value not drawn)
TP2  Testpoint-1mm  [TestPoint]  (value not drawn)
TP3  Testpoint-1mm  [TestPoint]  (value not drawn)
TP4  Testpoint-1mm  [TestPoint]  (value not drawn)
TP5  Testpoint-1mm  [TestPoint]  (value not drawn)
TP6  Testpoint-1mm  [TestPoint]  (value not drawn)
U6  Module Sim A7670C  [Module Sim A7670C]
U7  TXS0108E  [TXS0108E]
U8  SMF05CT1G  [SOT363]

### Ports
MCU_PIN_CTR_RI, MCU_PIN_RX1_SIM, MCU_PIN_TX1_SIM, NET_LIGHT, PWR_KEY_FR_MCU, PWR_KEY_PIN, RESET_PIN, RESET_PIN_FR_MCU, RF_ANT, RI_FR_SIM, RXD_FR_SIM, TXD_FR_SIM, VCC_3V3_MCU, VCC_VBAT, VDD_EXT_1V8

### Nets
GND: C29.1 C34.1 C35.1 C36.1 C37.1 C38.1 C40.1 C41.1 C43.1 C44.1 C45.1 C46.1 C71.1 Q3.2(E) Q4.2(E) R23.2 R25.1 R26.2 S1.5(GND) U6.2(GND) U6.17(GND) U6.18(GND) U6.29(GND) U6.39(GND) U6.45(GND) U6.46(GND) U6.54(GND) U6.58(GND) U6.59(GND) U6.61(GND) U6.62(GND) U6.63(GND) U6.64(GND) U6.65(GND) U6.89(GND) U6.91(GND) U6.92(GND) U6.94(GND) U7.11(GND)
SIM_CLK: C44.2 R29.2 U6.32(SIM_CLK)
SIM_DATA: C43.2 R30.2 U6.31(SIM_DATA)
SIM_RST: C71.2 R28.2 U6.33(SIM_RST)
SIM_VDD: C45.2 C46.2 S1.1(VCC) U6.30(SIM_VDD) U8.6(CT5)
VCC_3V3_MCU: C40.2 U7.19(VCCB) ; port VCC_3V3_MCU
VCC_VBAT: C29.2 C34.2 C35.2 C36.2 U6.55(VBAT) U6.56(VBAT) U6.57(VBAT) ; port VCC_VBAT
NetAT1_1: AT1.1(AT) C38.2 R27.1
NetC37_2: C37.2 R27.2 U6.60(RF_ANT) ; port RF_ANT
NetC41_2: C41.2 TP4.1 U6.15(VDD_EXT_1V8) U7.2(VCCA) U7.10(OE) ; port VDD_EXT_1V8
NetD11_1: D11.1(A) U6.52(NETLIGHT) ; port NET_LIGHT
NetD11_2: D11.2(K) R25.2
NetQ3_1: Q3.1(B) R19.1 R23.1
NetQ3_3: Q3.3(C) U6.1(PWRKEY) ; port PWR_KEY_PIN
NetQ4_1: Q4.1(B) R24.1 R26.1
NetQ4_3: Q4.3(C) U6.16(RESET) ; port RESET_PIN
NetR19_2: R19.2 ; port PWR_KEY_FR_MCU
NetR24_2: R24.2 ; port RESET_PIN_FR_MCU
NetR28_1: R28.1 S1.2(RST) U8.1(CT1)
NetR29_1: R29.1 S1.3(CLK) U8.4(CT3)
NetR30_1: R30.1 S1.7(IO) U8.3(CT2)
NetTP1_1: TP1.1 U7.20(B1) ; port MCU_PIN_RX1_SIM
NetTP2_1: TP2.1 U7.18(B2) ; port MCU_PIN_TX1_SIM
NetTP3_1: TP3.1 U6.10(RXD) U7.3(A2) ; port RXD_FR_SIM
NetTP5_1: TP5.1 U6.9(TXD) U7.1(A1) ; port TXD_FR_SIM
NetTP6_1: TP6.1 U7.17(B3) ; port MCU_PIN_CTR_RI
NetU6_4: U6.4(RI) U7.4(A3) ; port RI_FR_SIM

Not connected (* = marked no-connect by the designer): AT1 2; S1 6(VPP)*; U6 3(DTR)* 5(DCD)* 6(USB_BOOT)* 7(CTS)* 8(RTS)* 11(SPI_CLK)* 12(SPI_CS)* 13(SPI_MOSI)* 14(SPI_MISO)* 19(GPIO1)* 20(MK_IN_3)* 21(MK_OUT_3)* 22(UART_LOG_RX)* 23(UART_LOG_TX)* 24(VBUS)* 25(ADC)* 26(GPIO2)* 27(USB_DP)* 28(USB_DM)* 34(SIM_DET) 35(MK_OUT_6)* 36(MK_IN_6)* 37(I2C_SDA)* 38(I2C_SCL)* 40(EAR_P)* 41(EAR_N)* 42(MIC_P)* 43(MIC_N)* 44(MK_OUT_2)* 47(MK_IN2)* 48(GPIO3)* 49(UART3_RXD)* 50(UART3_TXD)* 51(VBAT_ADC)* 53(GPIO4)* 66(STATUS)* 67(MK_OUT_5)* 68(MK_IN_5)* 90(GPS_ANT)* 93(BT_ANT)* 95(GNSS_TXD)* 96(GNSS_RXD)* 97(1V8_GNSS)* 98(GNSS_PWR)* 99(VDDO_2V8)* 100(1PPS)*; U7 5(A4) 6(A5) 7(A6) 8(A7) 9(A8) 12(B8) 13(B7) 14(B6) 15(B5)* 16(B4)*; U8 2(AN) 5(CT4)*

### Notes on the sheet
- Communication Sheet
- (in symbol Module Sim A7670C) SIM7670

### Library data of the parts
AT1 = RFCON171003SF6B001: CONNECTER ANTENNA GPS GSM; Solder: HAND; CompanyID: VT-00392; MPN: RFCON171003SF6B001; Value: AT-GSM-GPS
C29 C34 C40 C41 C43-C46 C71 = CAPC NF 0603: CAP SMD, Not Fill, 0603; Value: NF; Solder: Not Fill; Category: CAPACITOR
C35 C36 = CAP SMD 1210 100uF
C37 C38 = CAPC NF 0603: CAP SMD, Not Fill, 0603; Solder: Not Fill; Value: NF; Category: CAPACITOR
Q3 Q4 = 2SC1815: TRANS NPN 50V 0.15A SOT23-3; Solder: SMT; MPN: 2SC1815; Value: 2SC1815
R19 R23 R24 R26 R28-R30 = RESC NF 0603: RES SMD, Not Fill, 0603; Value: NF; Solder: Not Fill; Category: RESISTOR
R25 R27 = RESC NF 0603: RES SMD, Not Fill, 0603; Solder: Not Fill; Value: NF; Category: RESISTOR
U8 = SMF05CT1G: TVS DIODE 5VWM 12.5VC SC88; CompanyID: VT-00105; Solder: SMT; MPN: SMF05CT1G; Value: SMF05CT1G

## Sheet Sensors_Sheet.SchDoc
size A3; SheetNumber: 5; SheetTotal: 5
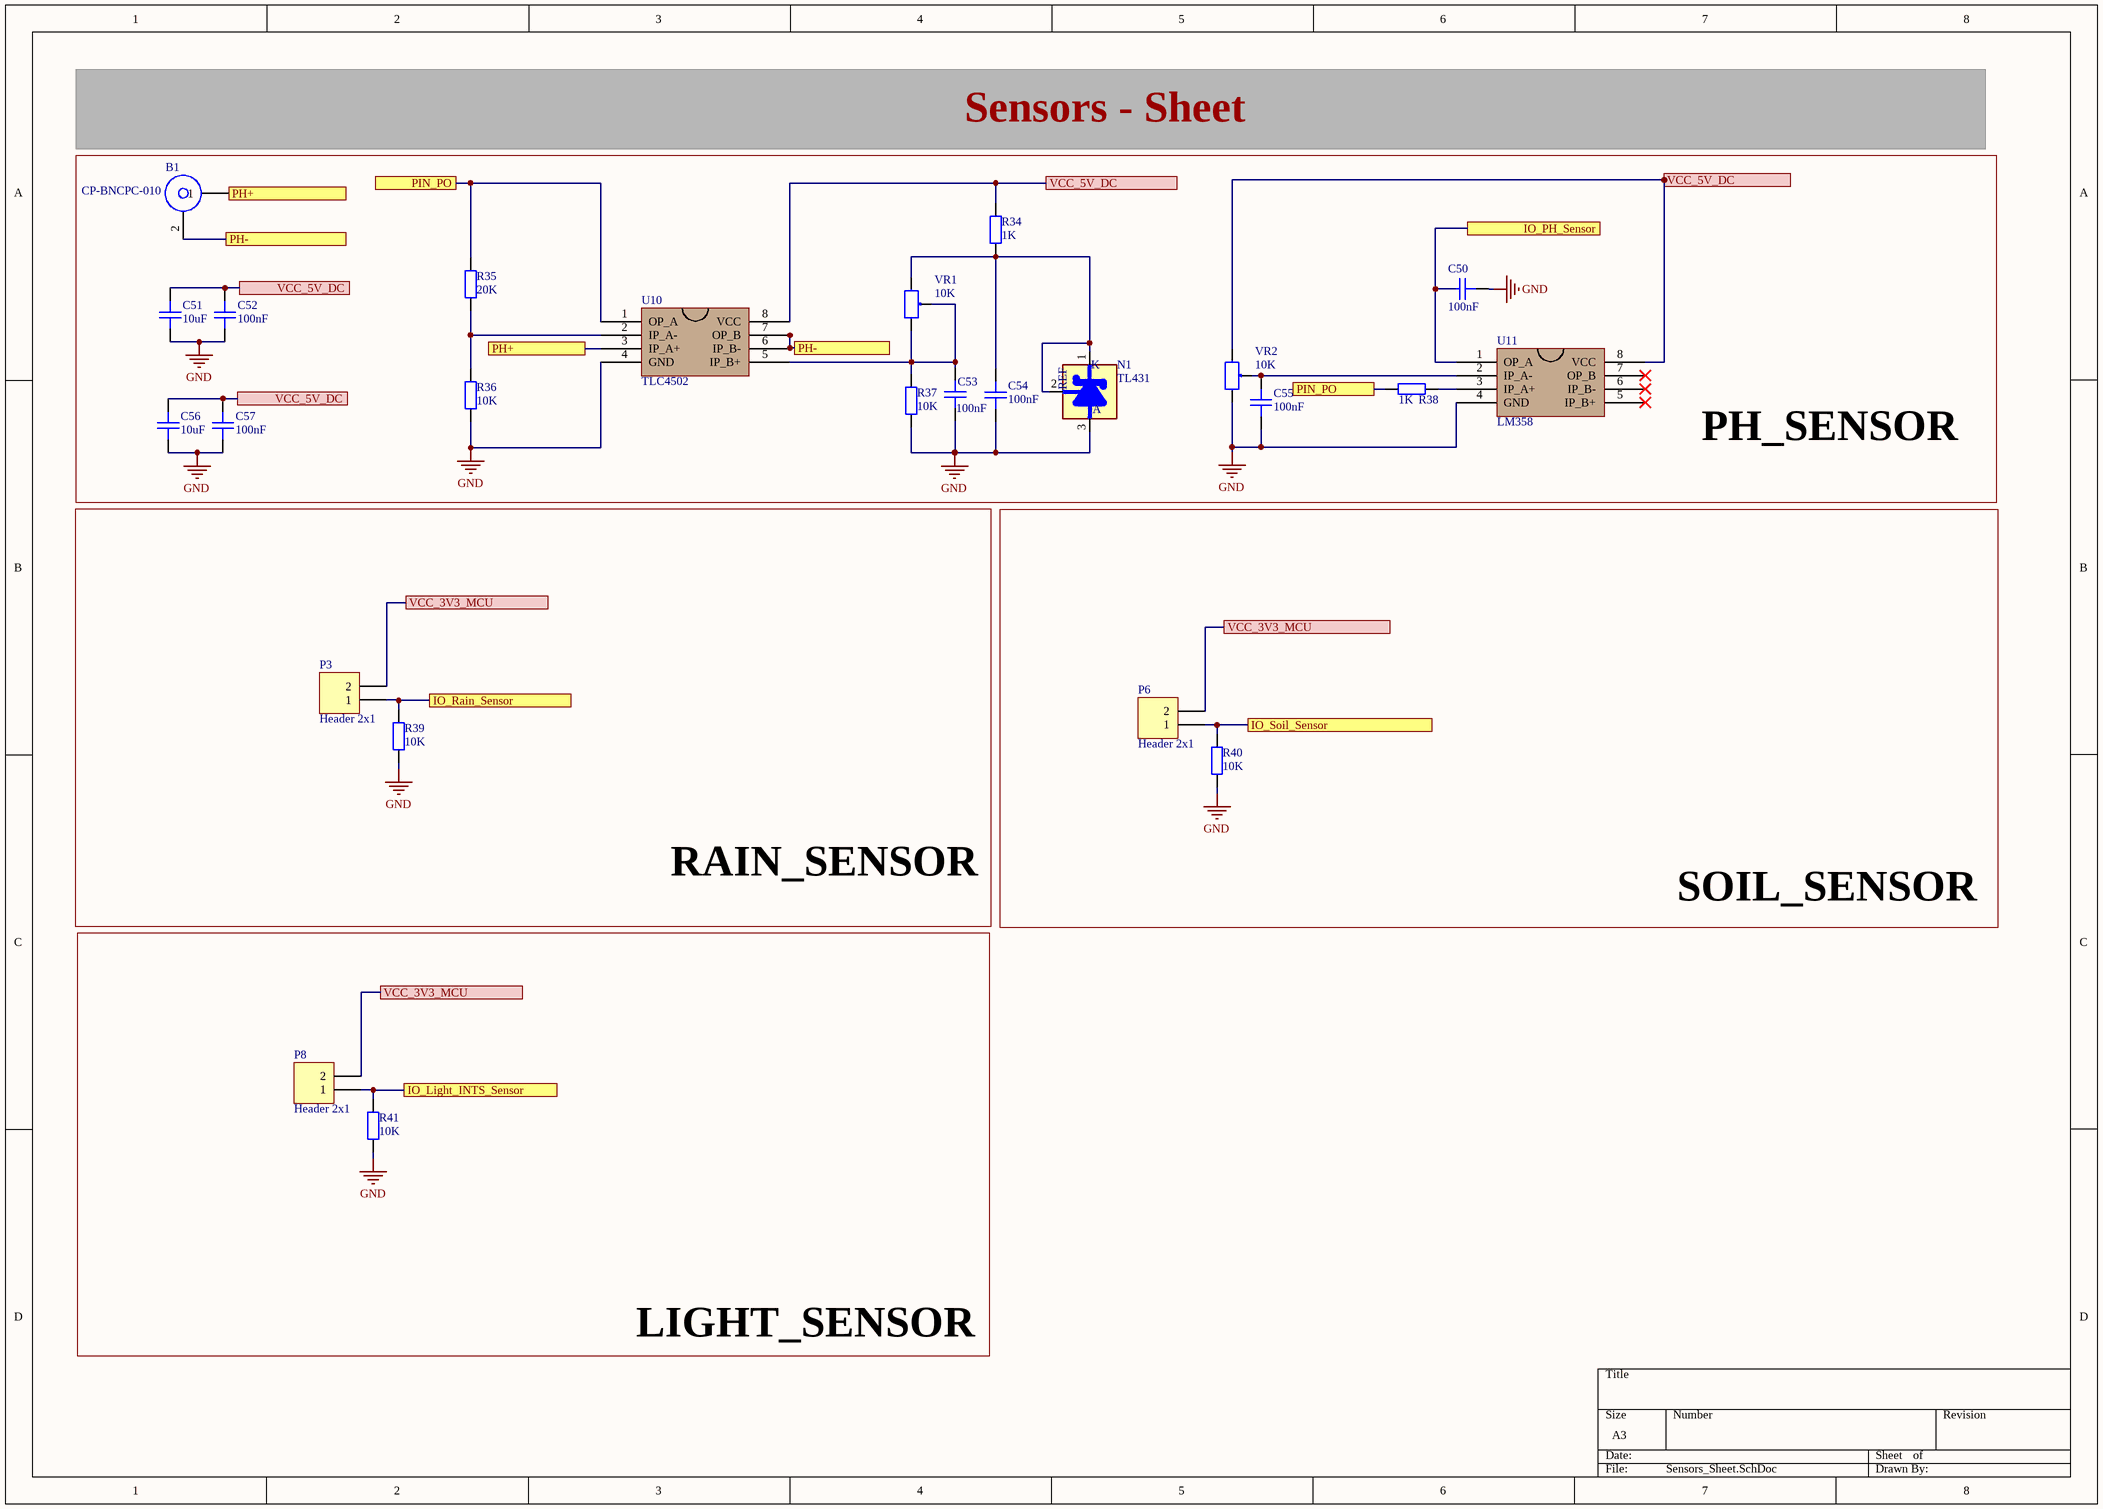
[diagram p5: Sensors_Sheet.SchDoc]

### Parts
B1  CP-BNCPC-010  [BNC]
C50  100nF  [CAPC-0603 (1608)]
C51  10uF  [CAPC-0603 (1608)]
C52  100nF  [CAPC-0603 (1608)]
C53  100nF  [CAPC-0603 (1608)]
C54  100nF  [CAPC-0603 (1608)]
C55  100nF  [CAPC-0603 (1608)]
C56  10uF  [CAPC-0603 (1608)]
C57  100nF  [CAPC-0603 (1608)]
N1  TL431  [SOT323]
P3  Header 2x1  [HDR1X2]
P6  Header 2x1  [HDR1X2]
P8  Header 2x1  [HDR1X2]
R34  1K  [RESC-0603 (1608)]
R35  20K  [RESC-0603 (1608)]
R36  10K  [RESC-0603 (1608)]
R37  10K  [RESC-0603 (1608)]
R38  1K  [RESC-0603 (1608)]
R39  10K  [RESC-0603 (1608)]
R40  10K  [RESC-0603 (1608)]
R41  10K  [RESC-0603 (1608)]
U10  TLC4502  [TLC4502]
U11  LM358  [LM358]
VR1  10K  [VR1]
VR2  10K  [VR1]

### Blocks framed on the sheet
PH_SENSOR: B1 C50-C57 N1 R34-R38 U10 U11 VR1 VR2
RAIN_SENSOR: P3 R39
SOIL_SENSOR: P6 R40
LIGHT_SENSOR: P8 R41

### Ports
IO_Light_INTS_Sensor, IO_PH_Sensor, IO_Rain_Sensor, IO_Soil_Sensor, PH+, PH-, PIN_PO, VCC_3V3_MCU, VCC_5V_DC

### Nets
GND: C50.1 C51.1 C52.1 C53.1 C54.1 C55.1 C56.1 C57.1 N1.3(A) R36.1 R37.1 R39.1 R40.1 R41.1 U10.4(GND) U11.4(GND) VR2.3
VCC_3V3_MCU: P3.2 P6.2 P8.2 ; port VCC_3V3_MCU
VCC_5V_DC: C51.2 C52.2 C56.2 C57.2 R34.2 U10.8(VCC) U11.8(VCC) VR2.1 ; port VCC_5V_DC
NetB1_1: B1.1 U10.3(IP_A+) ; port PH+
NetB1_2: B1.2 U10.6(IP_B-) U10.7(OP_B) ; port PH-
NetC50_2: C50.2 U11.1(OP_A) ; port IO_PH_Sensor
NetC53_2: C53.2 R37.2 U10.5(IP_B+) VR1.2 VR1.3
NetC54_2: C54.2 N1.1(K) N1.2(REF) R34.1 VR1.1
NetC55_2: C55.2 U11.2(IP_A-) VR2.2
NetP3_1: P3.1 R39.2 ; port IO_Rain_Sensor
NetP6_1: P6.1 R40.2 ; port IO_Soil_Sensor
NetP8_1: P8.1 R41.2 ; port IO_Light_INTS_Sensor
NetR35_1: R35.1 R36.2 U10.2(IP_A-)
NetR35_2: R35.2 R38.2 U10.1(OP_A) ; port PIN_PO
NetR38_1: R38.1 U11.3(IP_A+)

Not connected (* = marked no-connect by the designer): U11 5(IP_B+)* 6(IP_B-)* 7(OP_B)*

### Notes on the sheet
- Sensors - Sheet

### Library data of the parts
C50-C57 = CAPC NF 0603: CAP SMD, Not Fill, 0603; Value: NF; Solder: Not Fill; Category: CAPACITOR
N1 = TL431: IC VREF SHUNT ADJ 0.4% TO92-3; MF: onsemi; SnapEDA_Link: https://www.snapeda.com/parts/TL431/Onsemi/view-part/?ref=snap; Package: None; Value: *; MP: TL431; Check_prices: https://www.snapeda.com/parts/TL431/Onsemi/view-part/?ref=eda
P3 P6 P8 = Header 2x1: Header, 2-Pin, pitch 2.54mm; Solder: WAVE
R34-R41 = CRCW06035R10FKEA: as R1 on sheet Power_Sheet; MPN: CRCW06035R10FKEA; Category: RESISTOR; PinCount: 2
U11 = LM358D
VR1 VR2 = VR: Var Resistor; Value: VR 10K

## Nets that join several sheets
GND: U_Power_Sheet (29 pins), MCU_Sheet (46 pins), Comm_Sheet (39 pins), Sensors_Sheet (17 pins), U_Power_Sheet (29 pins)
NetC50_2: MCU_Sheet (U4.19), Sensors_Sheet (C50.2 U11.1)
NetP3_1: MCU_Sheet (U4.18), Sensors_Sheet (P3.1 R39.2)
NetP6_1: MCU_Sheet (U4.17), Sensors_Sheet (P6.1 R40.2)
NetP8_1: MCU_Sheet (U4.16), Sensors_Sheet (P8.1 R41.2)
NetR19_2: MCU_Sheet (U4.45), Comm_Sheet (R19.2)
NetR24_2: MCU_Sheet (U4.2), Comm_Sheet (R24.2)
NetTP1_1: MCU_Sheet (U4.43), Comm_Sheet (TP1.1 U7.20)
NetTP2_1: MCU_Sheet (U4.42), Comm_Sheet (TP2.1 U7.18)
NetTP6_1: MCU_Sheet (U4.46), Comm_Sheet (TP6.1 U7.17)
VCC_3V3_MCU: U_Power_Sheet (C13_U_Power_Sheet#1.1 C14_U_Power_Sheet#1.2 U3_U_Power_Sheet#1.2), MCU_Sheet (28 pins), Comm_Sheet (C40.2 U7.19), Sensors_Sheet (P3.2 P6.2 P8.2), U_Power_Sheet (C13_U_Power_Sheet#2.1 C14_U_Power_Sheet#2.2 U3_U_Power_Sheet#2.2)
VCC_5V_DC: U_Power_Sheet (5 pins), MCU_Sheet (8 pins), Sensors_Sheet (8 pins), U_Power_Sheet (5 pins)
VCC_11XV: U_Power_Sheet (6 pins), U_Power_Sheet (6 pins)
VCC_12V: U_Power_Sheet (D1_U_Power_Sheet#1.1 D7_U_Power_Sheet#1.1 JP1_U_Power_Sheet#1.1), U_Power_Sheet (D1_U_Power_Sheet#2.1 D7_U_Power_Sheet#2.1 JP1_U_Power_Sheet#2.1)
VCC_VBAT: U_Power_Sheet (8 pins), Comm_Sheet (7 pins), U_Power_Sheet (8 pins)